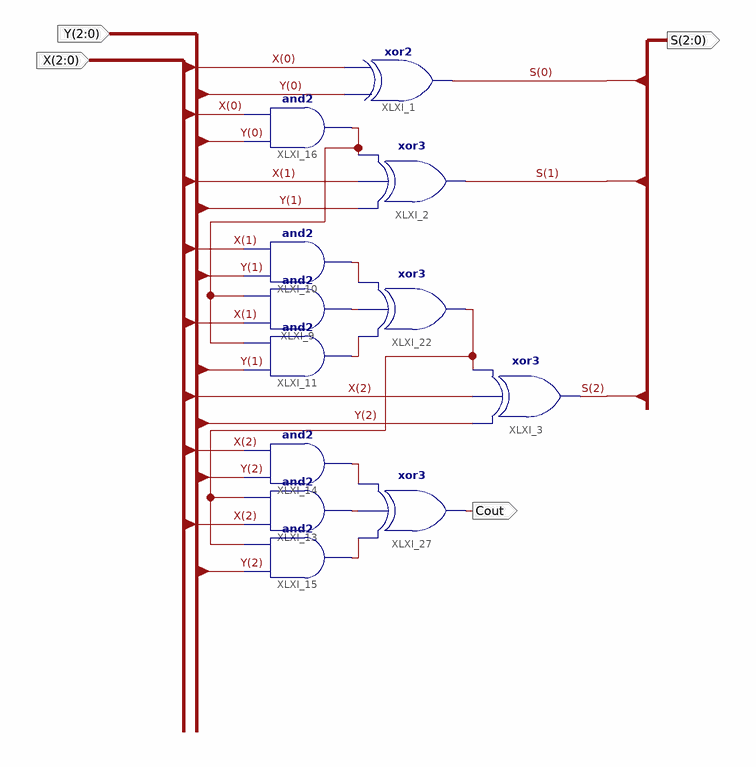
[diagram p0: schematic sheet 1]
// Xilinx ISE schematic exp4sch.sch (spartan3e) as structural Verilog: 12 symbols, 4 ports
module exp4sch (
  input  [2:0] X,
  input  [2:0] Y,
  output [2:0] S,
  output Cout
);

  wire XLXN_2, XLXN_3, XLXN_4, XLXN_5, XLXN_6, XLXN_7, XLXN_53, XLXN_54;

  xor XLXI_1 (S[0], Y[0], X[0]);
  xor XLXI_2 (S[1], Y[1], X[1], XLXN_53);
  and XLXI_16 (XLXN_53, Y[0], X[0]);
  and XLXI_9 (XLXN_3, X[1], XLXN_53);
  and XLXI_10 (XLXN_2, Y[1], X[1]);
  and XLXI_11 (XLXN_4, Y[1], XLXN_53);
  xor XLXI_3 (S[2], Y[2], X[2], XLXN_54);
  xor XLXI_22 (XLXN_54, XLXN_4, XLXN_3, XLXN_2);
  and XLXI_13 (XLXN_6, X[2], XLXN_54);
  and XLXI_14 (XLXN_5, Y[2], X[2]);
  and XLXI_15 (XLXN_7, Y[2], XLXN_54);
  xor XLXI_27 (Cout, XLXN_7, XLXN_6, XLXN_5);
endmodule
